# Altium schematic sheet LC.SchDoc
size A4
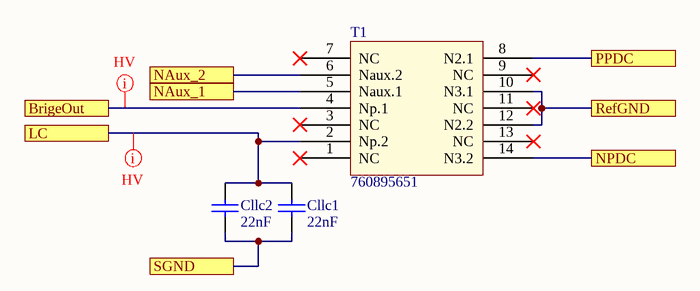
[diagram p0: LC.SchDoc]

## Parts
Cllc1  value 22nF  [1812]  (hidden comment: Cap)
Cllc2  value 22nF  [1812]  (hidden comment: Cap)
T1  760895651  [Transformer]

## Ports
BrigeOut, LC, NAux_1, NAux_2, NPDC, PPDC, RefGND, SGND

## Nets
BrigeOut: T1.4(Np.1) ; port BrigeOut
LC: Cllc1.2 Cllc2.2 T1.2(Np.2) ; port LC
NAux_1: T1.5(Naux.1) ; port NAux_1
NAux_2: T1.6(Naux.2) ; port NAux_2
NPDC: T1.14(N3.2) ; port NPDC
PPDC: T1.8(N2.1) ; port PPDC
RefGND: T1.10(N3.1) T1.12(N2.2) ; port RefGND
SGND: Cllc1.1 Cllc2.1 ; port SGND

Not connected (* = marked no-connect by the designer): T1 1(NC)* 3(NC)* 7(NC)* 9(NC)* 11(NC)* 13(NC)*

## Layout directives
mark named HV: BrigeOut, LC

## Library data of the parts
Cllc1 Cllc2 = Cap: Capacitor; Published: 8-Jun-2000; LatestRevisionDate: 17-Jul-2002; LatestRevisionNote: Re-released for DXP Platform.; PackageReference: RAD-0.3; Publisher: Altium Limited; PackageDescription: Radial Cap, Thru-Hole; 2 Leads; 0.3 in Pin Spacing; Supplier 1: Digi-Key; Supplier Part Number 1: 478-1138-6-ND
T1 = transformer: ComponentLink1Description: RS-Components; ComponentLink1URL: https://uk.rs-online.com/web/p/switch-mode-power-supply-smps-transformers/8235443/